# Altium schematic sheet MCU模块.SchDoc: MCU模块
size A3; Author: GAOYANG; Organization: Altium Limited; Address1: L3, 12a Rodborough Rd; Address2: Frenchs Forest; Address3: NSW; Address4: Australia 2086
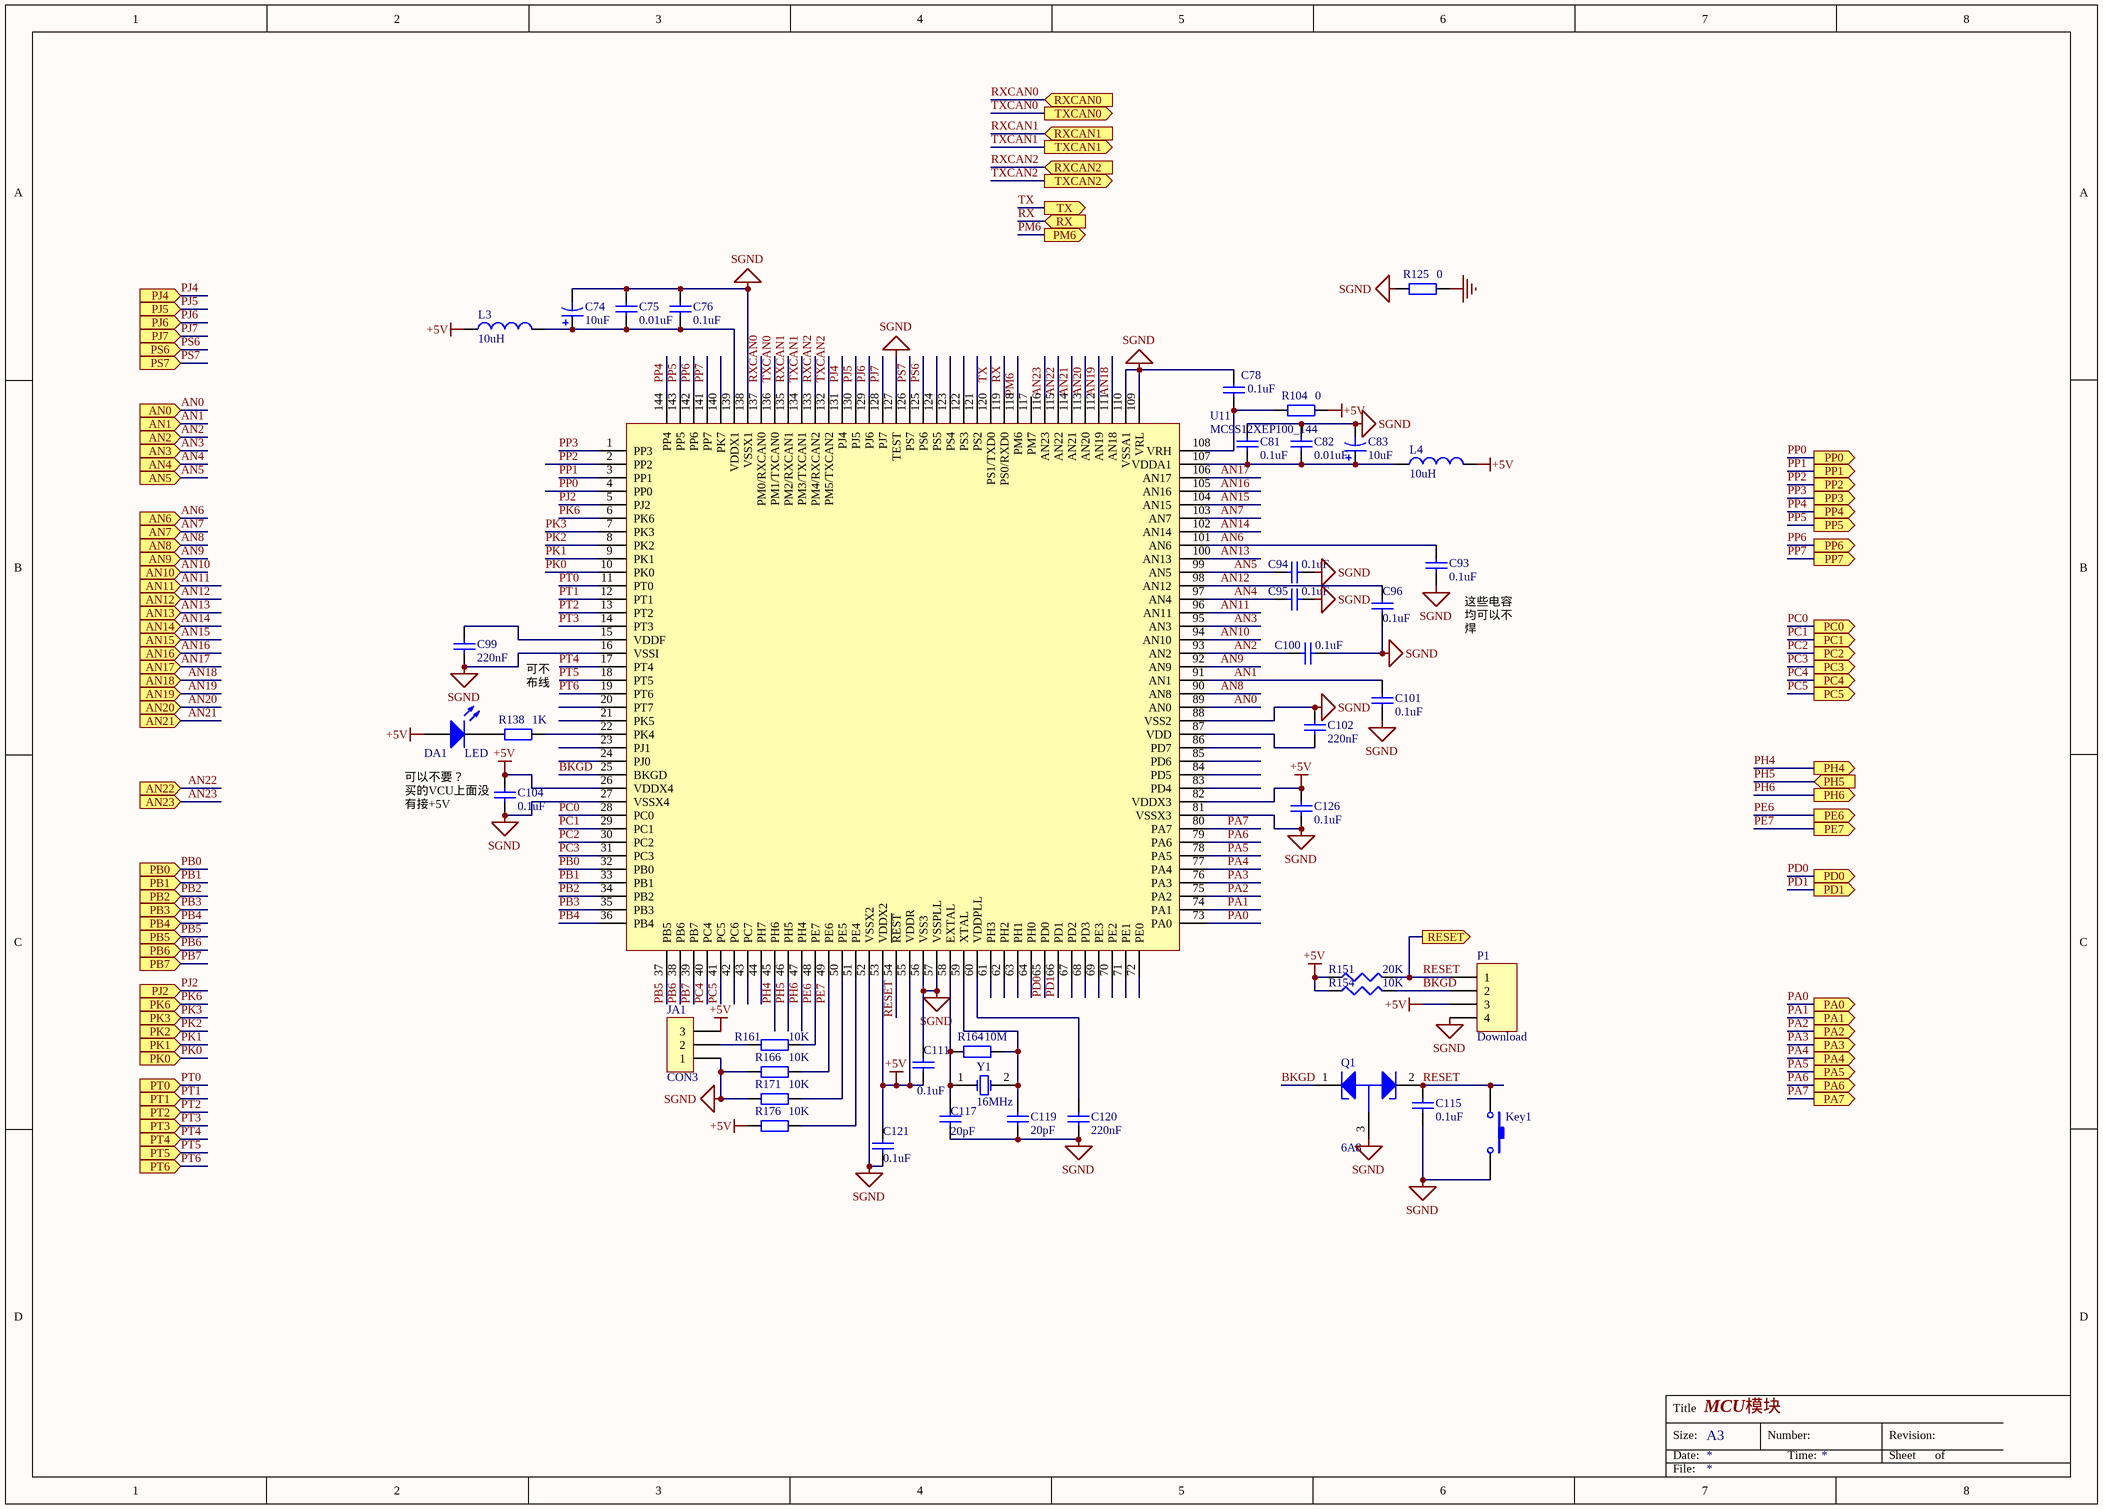
[diagram p0: MCU模块.SchDoc]

## Parts
C74  value 10uF  [RES1206]  (hidden comment: Cap Pol1)
C75  value 0.01uF  [0603-L]  (hidden comment: Cap)
C76  value 0.1uF  [0603-L]  (hidden comment: Cap)
C78  value 0.1uF  [0603-L]  (hidden comment: Cap)
C81  value 0.1uF  [0603-L]  (hidden comment: Cap)
C82  value 0.01uF  [0603-L]  (hidden comment: Cap)
C83  value 10uF  [RES1206]  (hidden comment: Cap Pol1)
C93  value 0.1uF  [0603-L]  (hidden comment: Cap)
C94  value 0.1uF  [0603-L]  (hidden comment: Cap)
C95  value 0.1uF  [0603-L]  (hidden comment: Cap)
C96  value 0.1uF  [0603-L]  (hidden comment: Cap)
C99  value 220nF  [RES1206]  (hidden comment: Cap)
C100  value 0.1uF  [0603-L]  (hidden comment: Cap)
C101  value 0.1uF  [0603-L]  (hidden comment: Cap)
C102  value 220nF  [RES1206]  (hidden comment: Cap)
C104  value 0.1uF  [0603-L]  (hidden comment: Cap)
C111  value 0.1uF  [0603-L]  (hidden comment: Cap)
C115  value 0.1uF  [0603-L]  (hidden comment: Cap)
C117  value 20pF  [RES0805]  (hidden comment: Cap)
C119  value 20pF  [RES0805]  (hidden comment: Cap)
C120  value 220nF  [RES1206]  (hidden comment: Cap)
C121  value 0.1uF  [0603-L]  (hidden comment: Cap)
C126  value 0.1uF  [0603-L]  (hidden comment: Cap)
DA1  LED  [0603-L]
JA1  CON3  [HDR1X3]
Key1  SW-PB  [KEY]  (value not drawn)
L3  value 10uH  [RES1206]  (hidden comment: Inductor)
L4  value 10uH  [RES1206]  (hidden comment: Inductor)
P1  Download  [HDR1X4]
Q1  6A8  [transistors]
R104  value 0  [RES1206]  (hidden comment: Res2)
R125  value 0  [RES1206]  (hidden comment: Res2)
R138  value 1K  [0603-L]  (hidden comment: Res2)
R151  value 20K  [0603-L]  (hidden comment: Res3)
R154  value 10K  [0603-L]  (hidden comment: Res3)
R161  value 10K  [0603-L]  (hidden comment: Res2)
R164  value 10M  [0603-L]  (hidden comment: Res2)
R166  value 10K  [0603-L]  (hidden comment: Res2)
R171  value 10K  [0603-L]  (hidden comment: Res2)
R176  value 10K  [0603-L]  (hidden comment: Res2)
U11  MC9S12XEP100_144  [MC9S12XEP100RMV1]
Y1  16MHz  [XTAL1_1]

## Ports
AN0 (in), AN1 (in), AN2 (in), AN3 (in), AN4 (in), AN5 (in), AN6 (in), AN7 (in), AN8 (in), AN9 (in), AN10 (in), AN11 (in), AN12 (in), AN13 (in), AN14 (in), AN15 (in), AN16 (in), AN17 (in), AN18 (in), AN19 (in), AN20 (in), AN21 (in), AN22 (in), AN23 (in), PA0 (out), PA1 (out), PA2 (out), PA3 (out), PA4 (out), PA5 (out), PA6 (out), PA7 (out), PB0 (in), PB1 (in), PB2 (in), PB3 (in), PB4 (in), PB5 (in), PB6 (in), PB7 (in), PC0 (out), PC1 (out), PC2 (out), PC3 (out), PC4 (out), PC5 (out), PD0 (out), PD1 (out), PE6 (out), PE7 (out), PH4 (out), PH5 (in), PH6 (out), PJ2 (in), PJ4 (in), PJ5 (in), PJ6 (in), PJ7 (in), PK0 (in), PK1 (in), PK2 (in), PK3 (in), PK6 (in), PM6 (out), PP0 (out), PP1 (out), PP2 (out), PP3 (out), PP4 (out), PP5 (out), PP6 (out), PP7 (out), PS6 (in), PS7 (in), PT0 (in), PT1 (in), PT2 (in), PT3 (in), PT4 (in), PT5 (in), PT6 (in), RESET (out), RX (in), RXCAN0 (in), RXCAN1 (in), RXCAN2 (in), TX (out), TXCAN0 (out), TXCAN1 (out), TXCAN2 (out)

## Nets
+5V: C104.1 C111.1 C121.2 C126.1 DA1.1(A) JA1.3 L3.1 L4.2 P1.3 R104.2 R151.1 R154.1 R176.1 U11.26(VDDX4) U11.53(VDDX2) U11.55(VDDR) U11.82(VDDX3)
GND: R125.2
SGND: C74.2 C75.2 C76.2 C78.2 C81.1 C82.1 C83.2 C93.1 C94.1 C95.1 C96.2 C99.1 C100.1 C101.2 C102.1 C104.2 C111.2 C115.1 C117.1 C119.1 C120.1 C121.1 C126.2 JA1.1 Key1.2 P1.4 Q1.3(C) R125.1 R166.1 R171.1 U11.16(VSSI) U11.27(VSSX4) U11.52(VSSX2) U11.56(VSS3) U11.57(VSSPLL) U11.81(VSSX3) U11.88(VSS2) U11.109(VRL) U11.110(VSSA1) U11.127(TEST) U11.138(VSSX1)
AN0: U11.89(AN0) ; port AN0
AN1: C101.1 U11.91(AN1) ; port AN1
AN2: C100.2 U11.93(AN2) ; port AN2
AN3: U11.95(AN3) ; port AN3
AN4: C95.2 U11.97(AN4) ; port AN4
AN5: C94.2 U11.99(AN5) ; port AN5
AN6: C93.2 U11.101(AN6) ; port AN6
AN7: U11.103(AN7) ; port AN7
AN8: U11.90(AN8) ; port AN8
AN9: U11.92(AN9) ; port AN9
AN10: U11.94(AN10) ; port AN10
AN11: U11.96(AN11) ; port AN11
AN12: C96.1 U11.98(AN12) ; port AN12
AN13: U11.100(AN13) ; port AN13
AN14: U11.102(AN14) ; port AN14
AN15: U11.104(AN15) ; port AN15
AN16: U11.105(AN16) ; port AN16
AN17: U11.106(AN17) ; port AN17
AN18: U11.111(AN18) ; port AN18
AN19: U11.112(AN19) ; port AN19
AN20: U11.113(AN20) ; port AN20
AN21: U11.114(AN21) ; port AN21
AN22: U11.115(AN22) ; port AN22
AN23: U11.116(AN23) ; port AN23
BKGD: P1.2 Q1.1(B) R154.2 U11.25(BKGD)
PA0: U11.73(PA0) ; port PA0
PA1: U11.74(PA1) ; port PA1
PA2: U11.75(PA2) ; port PA2
PA3: U11.76(PA3) ; port PA3
PA4: U11.77(PA4) ; port PA4
PA5: U11.78(PA5) ; port PA5
PA6: U11.79(PA6) ; port PA6
PA7: U11.80(PA7) ; port PA7
PB0: U11.32(PB0) ; port PB0
PB1: U11.33(PB1) ; port PB1
PB2: U11.34(PB2) ; port PB2
PB3: U11.35(PB3) ; port PB3
PB4: U11.36(PB4) ; port PB4
PB5: U11.37(PB5) ; port PB5
PB6: U11.38(PB6) ; port PB6
PB7: U11.39(PB7) ; port PB7
PC0: U11.28(PC0) ; port PC0
PC1: U11.29(PC1) ; port PC1
PC2: U11.30(PC2) ; port PC2
PC3: U11.31(PC3) ; port PC3
PC4: U11.40(PC4) ; port PC4
PC5: U11.41(PC5) ; port PC5
PD0: U11.65(PD0) ; port PD0
PD1: U11.66(PD1) ; port PD1
PE6: R161.2 U11.48(PE7) ; port PE6
PE7: R166.2 U11.49(PE6) ; port PE7
PH4: U11.45(PH6) ; port PH4
PH5: U11.46(PH5) ; port PH5
PH6: U11.47(PH4) ; port PH6
PJ2: U11.5(PJ2) ; port PJ2
PJ4: U11.131(PJ4) ; port PJ4
PJ5: U11.130(PJ5) ; port PJ5
PJ6: U11.129(PJ6) ; port PJ6
PJ7: U11.128(PJ7) ; port PJ7
PK0: U11.10(PK0) ; port PK0
PK1: U11.9(PK1) ; port PK1
PK2: U11.8(PK2) ; port PK2
PK3: U11.7(PK3) ; port PK3
PK6: U11.6(PK6) ; port PK6
PM6: U11.118(PM6) ; port PM6
PP0: U11.4(PP0) ; port PP0
PP1: U11.3(PP1) ; port PP1
PP2: U11.2(PP2) ; port PP2
PP3: U11.1(PP3) ; port PP3
PP4: U11.144(PP4) ; port PP4
PP5: U11.143(PP5) ; port PP5
PP6: U11.142(PP6) ; port PP6
PP7: U11.141(PP7) ; port PP7
PS6: U11.125(PS6) ; port PS6
PS7: U11.126(PS7) ; port PS7
PT0: U11.11(PT0) ; port PT0
PT1: U11.12(PT1) ; port PT1
PT2: U11.13(PT2) ; port PT2
PT3: U11.14(PT3) ; port PT3
PT4: U11.17(PT4) ; port PT4
PT5: U11.18(PT5) ; port PT5
PT6: U11.19(PT6) ; port PT6
RESET: C115.2 Key1.1 P1.1 Q1.2(E) R151.2 U11.54(~{REST}) ; port RESET
RX: U11.119(PS0/RXD0) ; port RX
RXCAN0: U11.137(PM0/RXCAN0) ; port RXCAN0
RXCAN1: U11.135(PM2/RXCAN1) ; port RXCAN1
RXCAN2: U11.133(PM4/RXCAN2) ; port RXCAN2
TX: U11.120(PS1/TXD0) ; port TX
TXCAN0: U11.136(PM1/TXCAN0) ; port TXCAN0
TXCAN1: U11.134(PM3/TXCAN1) ; port TXCAN1
TXCAN2: U11.132(PM5/TXCAN2) ; port TXCAN2
NetC74_1: C74.1 C75.1 C76.1 L3.2 U11.139(VDDX1)
NetC78_1: C78.1 R104.1 U11.108(VRH)
NetC81_2: C81.2 C82.2 C83.1 L4.1 U11.107(VDDA1)
NetC99_2: C99.2 U11.15(VDDF)
NetC102_2: C102.2 U11.87(VDD)
NetC117_2: C117.2 R164.1 U11.58(EXTAL) Y1.1(OSC1)
NetC119_2: C119.2 R164.2 U11.59(XTAL) Y1.2(OSC2)
NetC120_2: C120.2 U11.60(VDDPLL)
NetDA1_2: DA1.2(K) R138.1
NetJA1_2: JA1.2 R161.1
NetR138_2: R138.2 U11.22(PK4)
NetR171_2: R171.2 U11.50(PE5)
NetR176_2: R176.2 U11.51(PE4)

Not connected (* = marked no-connect by the designer): U11 20(PT7) 21(PK5) 23(PJ1) 24(PJ0) 42(PC6) 43(PC7) 44(PH7) 61(PH3) 62(PH2) 63(PH1) 64(PH0) 67(PD2) 68(PD3) 69(PE3) 70(PE2) 71(PE1) 72(PE0) 83(PD4) 84(PD5) 85(PD6) 86(PD7) 117(PM7) 121(PS2) 122(PS3) 123(PS4) 124(PS5) 140(PK7)

## Notes on the sheet
- (near C93) 这些电容均可以不焊
- (near R138) 可不布线
- (near C104) 可以不要？
  买的VCU上面没有接+5V
- Title
- Size:
- Date:
- A3
- Number:
- Time:
- Revision:
- Sheet
- of
- File:

## Library data of the parts
C74 C83 = Cap Pol1: Polarized Capacitor (Radial); Published: 8-Jun-2000; LatestRevisionDate: 17-Jul-2002; LatestRevisionNote: Re-released for DXP Platform.; PackageReference: RB7.6-15; Publisher: Altium Limited; PackageDescription: Polarized Capacitor (Radial); 2 Leads
C75 C82 C99 C102 C117 C119 C120 = Cap: Capacitor; Published: 8-Jun-2000; LatestRevisionDate: 17-Jul-2002; LatestRevisionNote: Re-released for DXP Platform.; PackageReference: RAD-0.3; Publisher: Altium Limited; PackageDescription: Radial Cap, Thru-Hole; 2 Leads; 0.3 in Pin Spacing
C76 C78 C81 C93-C96 C100 C101 C104 C111 C115 C121 C126 = Cap: Ceramic, X7R, 100V, 10%, 0603; Published: 8-Jun-2000; LatestRevisionDate: 17-Jul-2002; LatestRevisionNote: Re-released for DXP Platform.; PackageReference: RAD-0.3; Publisher: Altium Limited; PackageDescription: Radial Cap, Thru-Hole; 2 Leads; 0.3 in Pin Spacing
DA1 = LED0: Typical INFRARED GaAs LED; Published: 8-Jun-2000; LatestRevisionDate: 08-Jul-2005; LatestRevisionNote: Mech Layer 1 removed.; PackageReference: LED-0; Publisher: Altium Limited; PackageDescription: LED; 2 Leads
Key1 = SW-PB: Switch; Published: 24-Mar-1999; LatestRevisionDate: 17-Jul-2002; LatestRevisionNote: Re-released for DXP Platform.; PackageReference: SPST-2; Publisher: Altium Limited; PackageDescription: Switch; 2 Leads
L3 L4 = Inductor: Code_IEC: 1005; Published: 8-Jun-2000; LatestRevisionDate: 29-May-2009; LatestRevisionNote: IPC-7351 Footprint Added.; PackageReference: 0402-A; Publisher: Altium Limited; PackageDescription: Chip Inductor; Code_JEITA: 0402
P1 = Header 4: Header, 4-Pin; LatestRevisionDate: 17-Jul-2002; LatestRevisionNote: Re-released for DXP Platform.; Publisher: Altium Limited
R104 R125 R138 R161 R164 R166 R171 R176 = Res2: Resistor; Published: 8-Jun-2000; LatestRevisionDate: 17-Jul-2002; LatestRevisionNote: Re-released for DXP Platform.; PackageReference: AXIAL-0.4; Publisher: Altium Limited; PackageDescription: Axial Device, Thru-Hole; 2 Leads; 0.4 in Pin Spacing
R151 R154 = Res3: Resistor; Published: 8-Jun-2000; LatestRevisionDate: 29-May-2009; LatestRevisionNote: IPC-7351 Footprint Added.; PackageReference: J1-0603; Publisher: Altium Limited; PackageDescription: Chip Resistor
Y1 = XTAL: Crystal Oscillator; Published: 8-Jun-2000; LatestRevisionDate: 17-Jul-2002; LatestRevisionNote: Re-released for DXP Platform.; PackageReference: R38; Publisher: Altium Limited; PackageDescription: Crystal, Thru-Hole; 2 Leads; Body 3.1 x 8.2 mm (Dia.xH)